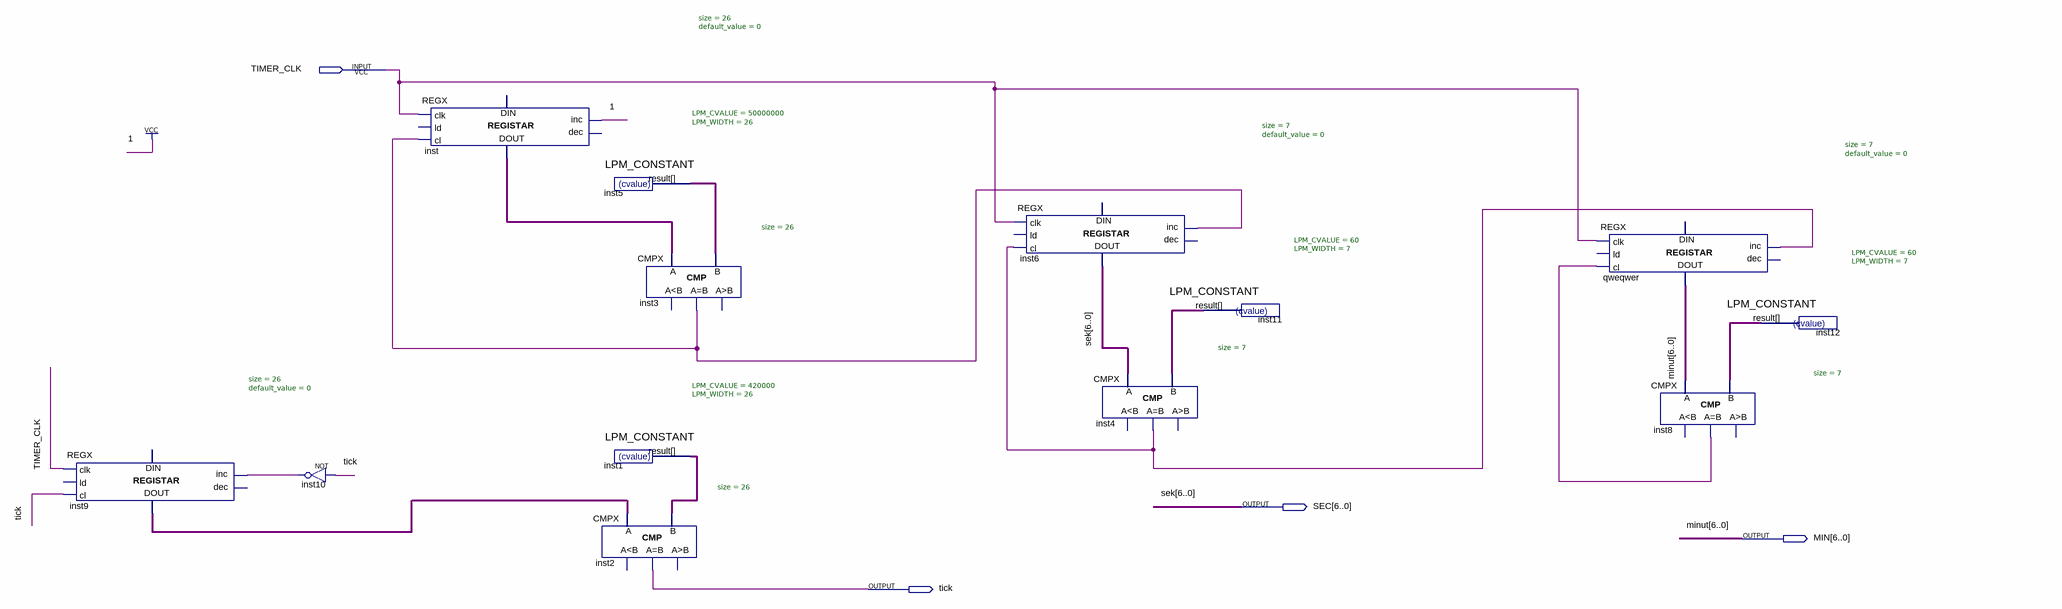
[diagram p0: schematic sheet]
// Quartus schematic timer.bdf as structural Verilog: 13 symbols, 4 pins
module timer (
  input  TIMER_CLK,
  output [6:0] SEC,
  output [6:0] MIN,
  output tick
);

  wire inst3_eq, inst4_eq, inst8_eq, inst10_out;
  wire [6:0] inst11_result, inst12_result;
  wire [25:0] inst1_result, inst5_result, inst9_data_out, inst_data_out;

  REGX #(.size(26), .default_value(0)) inst9 (
    .clk(TIMER_CLK), .cl(tick), .inc(inst10_out), .data_out(inst9_data_out));  // open: ld, dec, data_in
  not inst10 (inst10_out, tick);
  REGX #(.size(26), .default_value(0)) inst (
    .clk(TIMER_CLK), .cl(inst3_eq), .inc(1'b1), .data_out(inst_data_out));  // open: ld, dec, data_in
  CMPX #(.size(26)) inst2 (.A(inst9_data_out), .B(inst1_result), .eq(tick));  // open: ls, gr
  LPM_CONSTANT #(.LPM_CVALUE(50000000), .LPM_WIDTH(26)) inst5 (.result(inst5_result));
  CMPX #(.size(26)) inst3 (.A(inst_data_out), .B(inst5_result), .eq(inst3_eq));  // open: ls, gr
  LPM_CONSTANT #(.LPM_CVALUE(420000), .LPM_WIDTH(26)) inst1 (.result(inst1_result));
  REGX #(.size(7), .default_value(0)) inst6 (
    .clk(TIMER_CLK), .cl(inst4_eq), .inc(inst3_eq), .data_out(SEC));  // open: ld, dec, data_in
  CMPX #(.size(7)) inst4 (.A(SEC), .B(inst11_result), .eq(inst4_eq));  // open: ls, gr
  LPM_CONSTANT #(.LPM_CVALUE(60), .LPM_WIDTH(7)) inst11 (.result(inst11_result));
  REGX #(.size(7), .default_value(0)) qweqwer (
    .clk(TIMER_CLK), .cl(inst8_eq), .inc(inst4_eq), .data_out(MIN));  // open: ld, dec, data_in
  CMPX #(.size(7)) inst8 (.A(MIN), .B(inst12_result), .eq(inst8_eq));  // open: ls, gr
  LPM_CONSTANT #(.LPM_CVALUE(60), .LPM_WIDTH(7)) inst12 (.result(inst12_result));

  // Other names for the same wires on the sheet: minut[6:0] = MIN; sek[6:0] = SEC
endmodule
